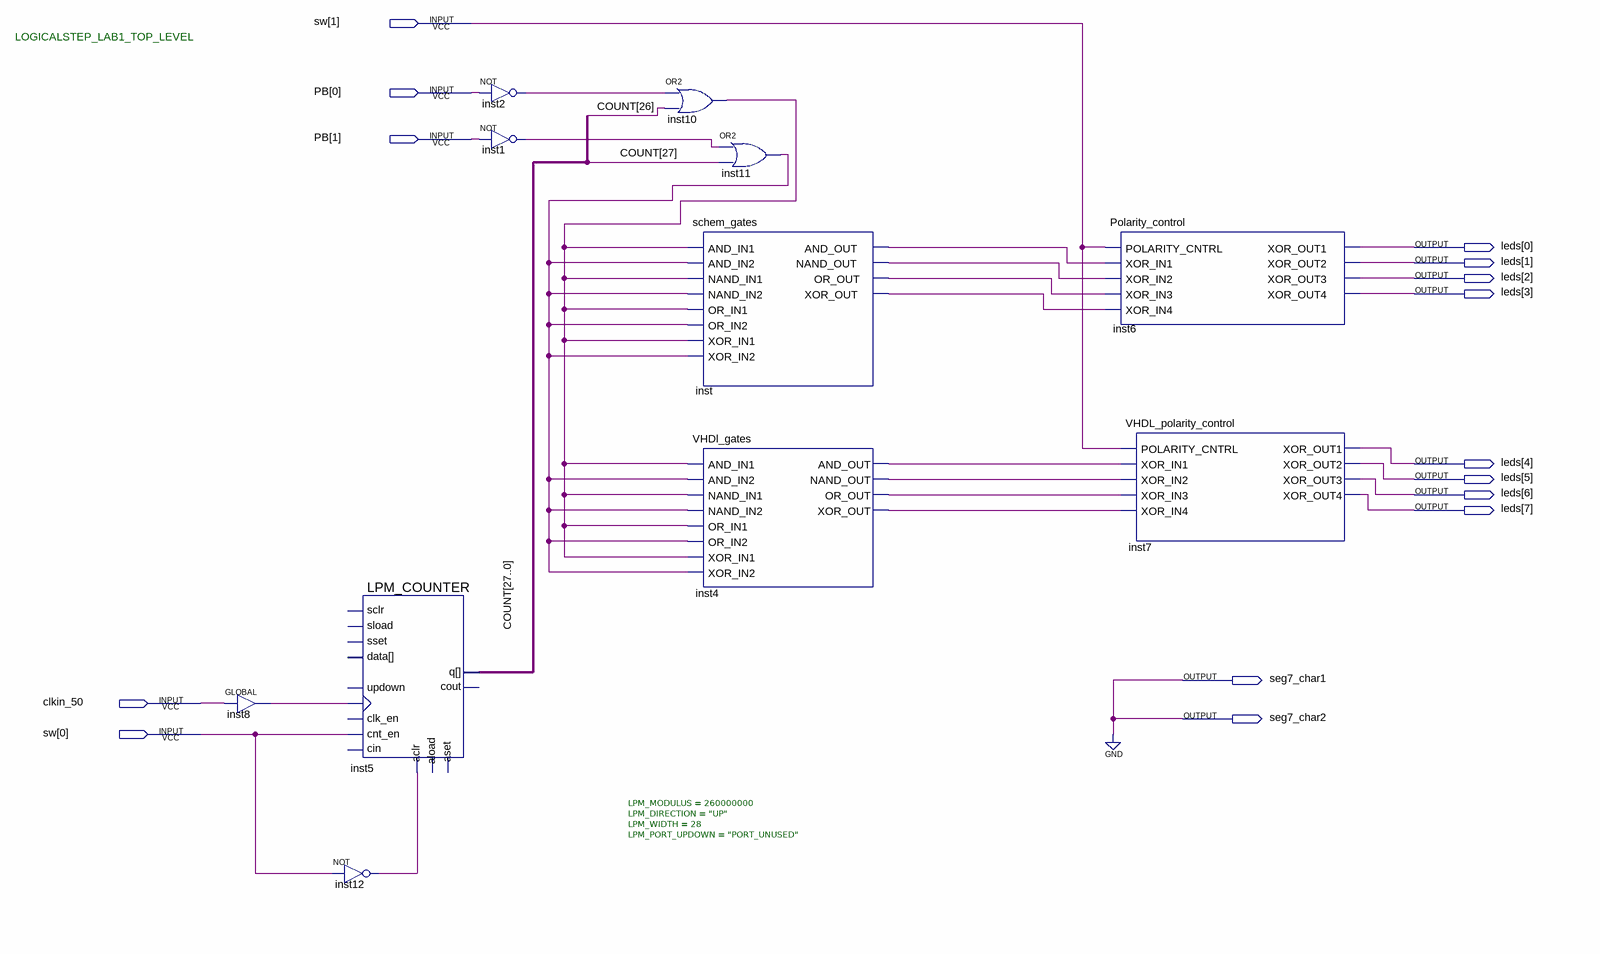
[diagram p0: schematic sheet]
// Quartus schematic LogicalStep_top.bdf as structural Verilog: 11 symbols, 15 pins
module LogicalStep_top (
  input  [1:0] sw,
  input  [1:0] PB,
  input  clkin_50,
  output [7:0] leds,
  output seg7_char1,
  output seg7_char2
);

  wire inst1_out, inst2_out, inst4_and_out, inst4_nand_out, inst4_or_out, inst4_xor_out, inst8_out,
       inst10_out, inst11_out, inst12_out, inst_and_out, inst_nand_out, inst_or_out, inst_xor_out;
  wire [27:0] COUNT;

  GLOBAL inst8 (.IN(clkin_50), .OUT(inst8_out));
  LPM_COUNTER #(.LPM_MODULUS(260000000), .LPM_DIRECTION("UP"), .LPM_WIDTH(28), .LPM_PORT_UPDOWN("PORT_UNUSED")) inst5 (
    .clock(inst8_out), .aclr(inst12_out), .cnt_en(sw[0]), .q(COUNT));  // open: sload, data, clk_en, aload, aset, cin, sset, updown, sclr, cout
  not inst12 (inst12_out, sw[0]);
  not inst2 (inst2_out, PB[0]);
  not inst1 (inst1_out, PB[1]);
  or inst10 (inst10_out, inst2_out, COUNT[26]);
  schem_gates inst (
    .AND_IN1(inst10_out), .AND_IN2(inst11_out), .NAND_IN1(inst10_out), .NAND_IN2(inst11_out),
    .OR_IN1(inst10_out), .OR_IN2(inst11_out), .XOR_IN1(inst10_out), .XOR_IN2(inst11_out),
    .AND_OUT(inst_and_out), .NAND_OUT(inst_nand_out), .OR_OUT(inst_or_out), .XOR_OUT(inst_xor_out));
  VHDl_gates inst4 (
    .AND_IN1(inst10_out), .AND_IN2(inst11_out), .NAND_IN1(inst10_out), .NAND_IN2(inst11_out),
    .OR_IN1(inst10_out), .OR_IN2(inst11_out), .XOR_IN1(inst10_out), .XOR_IN2(inst11_out),
    .AND_OUT(inst4_and_out), .NAND_OUT(inst4_nand_out), .OR_OUT(inst4_or_out), .XOR_OUT(inst4_xor_out));
  or inst11 (inst11_out, inst1_out, COUNT[27]);
  Polarity_control inst6 (
    .POLARITY_CNTRL(sw[1]), .XOR_IN1(inst_and_out), .XOR_IN2(inst_nand_out), .XOR_IN3(inst_or_out),
    .XOR_IN4(inst_xor_out), .XOR_OUT1(leds[0]), .XOR_OUT2(leds[1]), .XOR_OUT3(leds[2]), .XOR_OUT4(leds[3]));
  VHDL_polarity_control inst7 (
    .POLARITY_CNTRL(sw[1]), .XOR_IN1(inst4_and_out), .XOR_IN2(inst4_nand_out), .XOR_IN3(inst4_or_out),
    .XOR_IN4(inst4_xor_out), .XOR_OUT1(leds[4]), .XOR_OUT2(leds[5]), .XOR_OUT3(leds[6]), .XOR_OUT4(leds[7]));

  assign seg7_char1 = 1'b0;
  assign seg7_char2 = 1'b0;

  // Notes on the sheet:
  //   LOGICALSTEP_LAB1_TOP_LEVEL
endmodule
